# Altium schematic sheet [04]Power Supplies.SchDoc
size A4; Organization: Altium Limited; Address1: L3, 12a Rodborough Rd; Address2: Frenchs Forest; Address3: NSW; Address4: Australia 2086
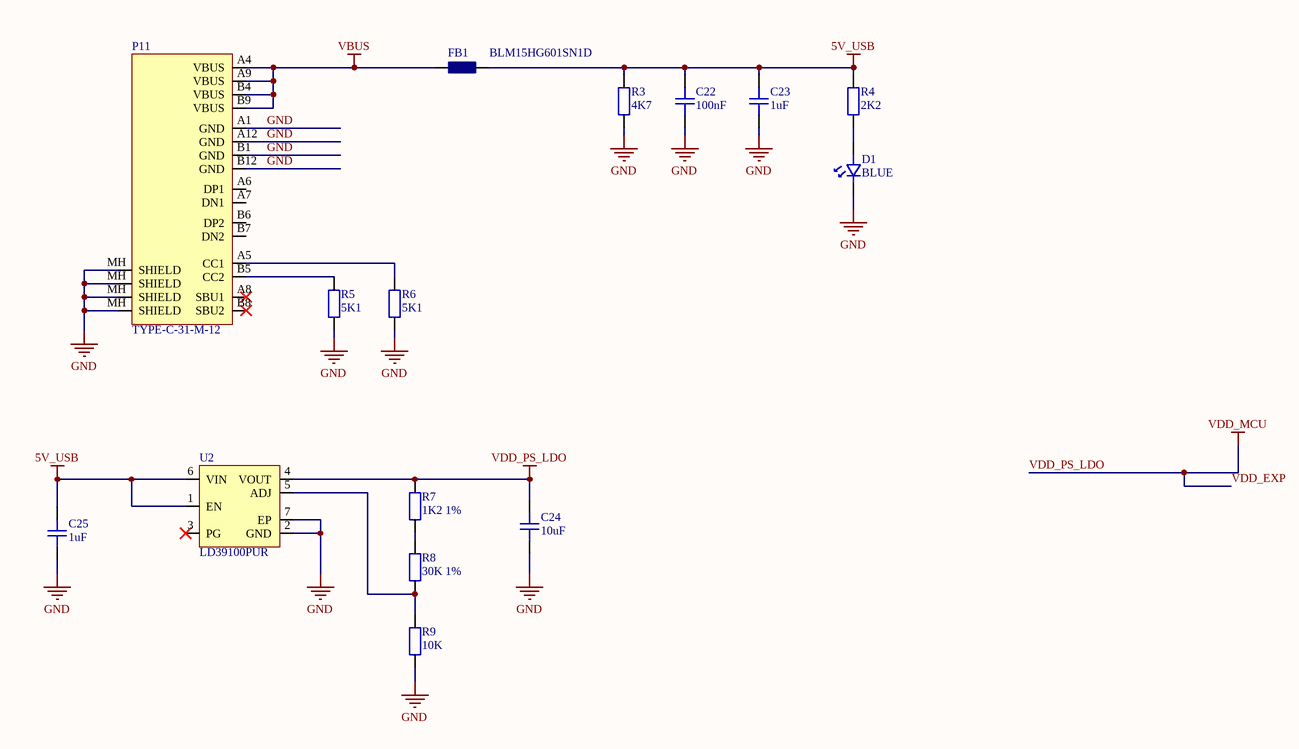
[diagram p0: [04]Power Supplies.SchDoc]

## Parts
C22  100nF  [CAPC1005L]
C23  1uF  [CAPC1005L]
C24  10uF  [CAPC1608N]
C25  1uF  [CAPC1005L]
D1  BLUE  [LEDC1608L]
FB1  BLM15HG601SN1D  [FBDC1005L]
P11  TYPE-C-31-M-12  [TYPE-C-31-M-12]
R3  4K7  [RESC1005L]
R4  2K2  [RESC1005L]
R5  5K1  [RESC1005L]
R6  5K1  [RESC1005L]
R7  1K2 1%  [RESC1005L]
R8  30K 1%  [RESC1005L]
R9  10K  [RESC1005L]
U2  LD39100PUR  [DFN6]

## Nets
5V_USB: C22.2 C23.2 C25.2 FB1.2 R3.2 R4.1 U2.1(EN) U2.6(VIN)
GND: C22.1 C23.1 C24.1 C25.1 D1.1 P11.A1(GND) P11.A12(GND) P11.B1(GND) P11.B12(GND) P11.MH(SHIELD) R3.1 R5.1 R6.1 R9.1 U2.2(GND) U2.7(EP)
VBUS: FB1.1 P11.A4(VBUS) P11.A9(VBUS) P11.B4(VBUS) P11.B9(VBUS)
VDD_EXP: C24.2 R7.2 U2.4(VOUT)  [also labelled VDD_MCU, VDD_PS_LDO]
NetD1_2: D1.2 R4.2
NetP11_A5: P11.A5(CC1) R6.2
NetP11_B5: P11.B5(CC2) R5.2
NetR7_1: R7.1 R8.2
NetR8_1: R8.1 R9.2 U2.5(ADJ)

Not connected (* = marked no-connect by the designer): P11 A6(DP1) A7(DN1) A8(SBU1)* B6(DP2) B7(DN2) B8(SBU2)*; U2 3(PG)*

## Notes on the sheet
- Title
- Size:
- Date:
- A4
- Number:
- Time:
- Revision:
- Sheet
- of
- File:

## Library data of the parts
C22-C25 = CAP_CHP: Surface Mount Unpolarized Capacitor
D1 = LED_SMD: Surface Mount LED
FB1 = FBD_CHP: Surface Mount Ferrite Bead
P11 = TYPE-C-31-M-12: USB Type-C Connector
R3-R9 = RES_CHP: Surface Mount Resistor
U2 = LD39100PUR: Voltage Regulator, 1A, Low Quiescent Current  ,DFN6 Tape&Reel